# EAGLE design MTAP-Embedded (EAGLE 9.6.2)
ABTEILUNG: Technische Informatik; BEARBEITER: Simon Grundner; DATUM: 2022/10/05; DOKUMENTART: Schaltplan; GEZ: GruS; ID: 4AHEL; REV: 1; SCHALTPLAN: MTAP-MIDI-GC; STATUS: Prototyp; VER: 1.0

## Sheet 1 of 3: ESP32 and Test Terminals
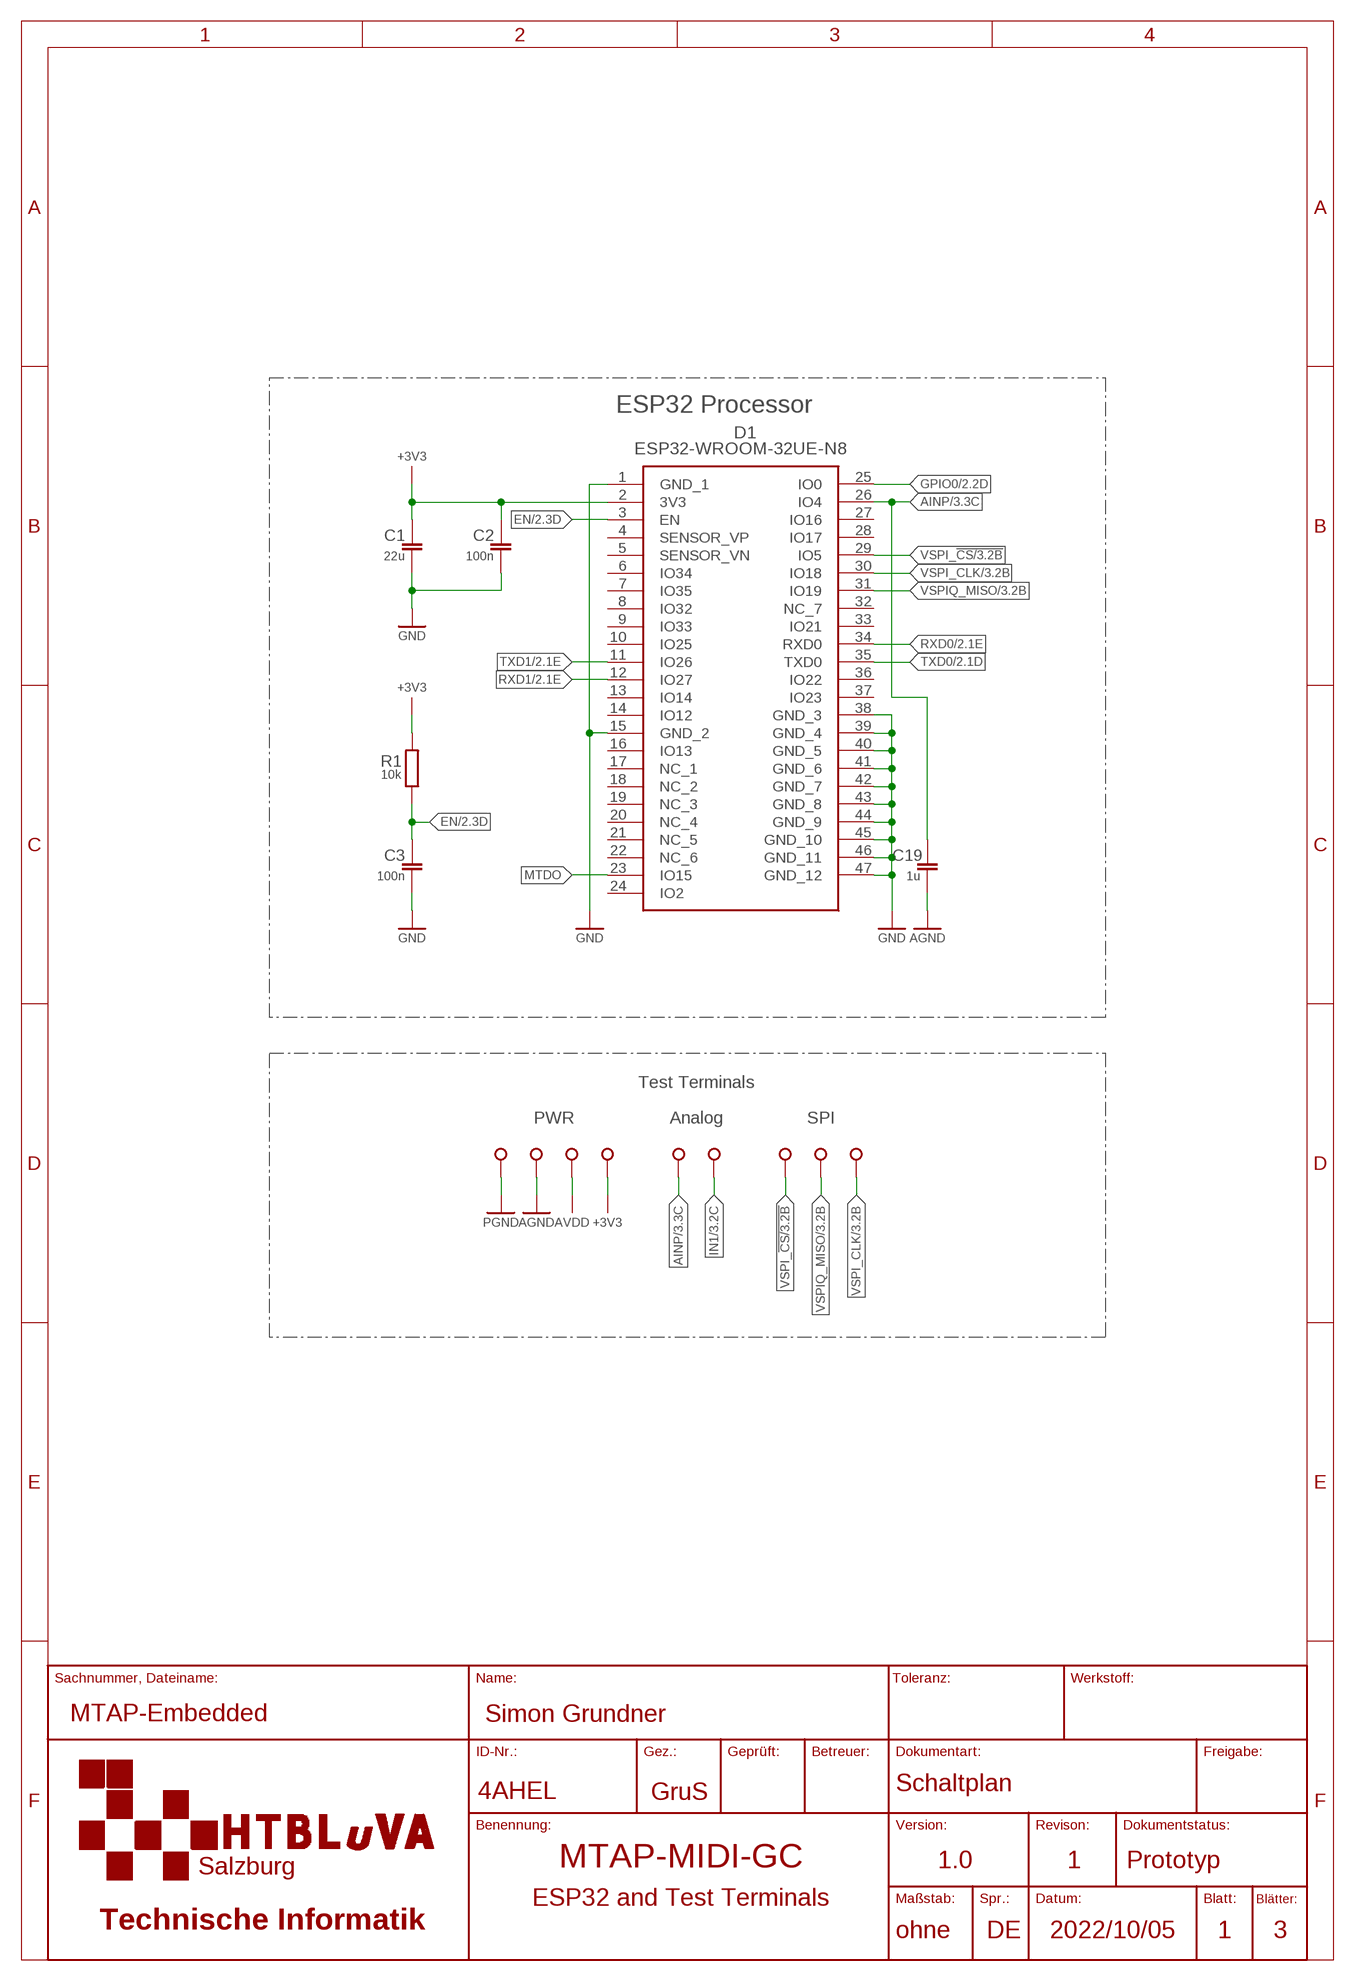
[diagram p0: schematic, sheet 1]

### Parts
3V3  SMD-TP  [S2751-46R]
AGND  SMD-TP  [S2751-46R]
AIN  SMD-TP  [S2751-46R]
AVDD  SMD-TP  [S2751-46R]
C1  22u  C-EUC0805  [C0805]
C2  100n  C-EUC0805  [C0805]
C3  100n  C-EUC0805  [C0805]
C19  1u  C-EUC0805  [C0805]
D1  ESP32-WROOM-32UE-N8  [ESP32WROOM32UEN8]
PGND  SMD-TP  [S2751-46R]
POST-AFE  SMD-TP  [S2751-46R]
R1  10k  R-EUSR0805  [R0805]
SPI_CLK  SMD-TP  [S2751-46R]
SPI_CS  SMD-TP  [S2751-46R]
SPIQ  SMD-TP  [S2751-46R]

### Nets
+3V3: 3V3.P$1 C1.1 C2.1 D1.2(3V3) R1.2 ; also sheet 2,3
AGND: AGND.P$1 C19.2 ; also sheet 2,3
AINP: C19.1 D1.26(IO4) POST-AFE.P$1 ; also sheet 3
AVDD: AVDD.P$1 ; also sheet 3
EN: C3.1 D1.3(EN) R1.1 ; also sheet 2
GND: C1.2 C2.2 C3.2 D1.1(GND_1) D1.15(GND_2) D1.38(GND_3) D1.39(GND_4) D1.40(GND_5) D1.41(GND_6) D1.42(GND_7) D1.43(GND_8) D1.44(GND_9) D1.45(GND_10) D1.46(GND_11) D1.47(GND_12) ; also sheet 2
GPIO0: D1.25(IO0) ; also sheet 2
IN1: AIN.P$1 ; also sheet 3
MTDO: D1.23(IO15)
PGND: PGND.P$1 ; also sheet 2
RXD0: D1.34(RXD0) ; also sheet 2
RXD1: D1.12(IO27) ; also sheet 2
TXD0: D1.35(TXD0) ; also sheet 2
TXD1: D1.11(IO26) ; also sheet 2
VSPI_!CS: D1.29(IO5) SPI_CS.P$1 ; also sheet 3
VSPI_CLK: D1.30(IO18) SPI_CLK.P$1 ; also sheet 3
VSPIQ_MISO: D1.31(IO19) SPIQ.P$1 ; also sheet 3
Unconnected: D1.4(SENSOR_VP) D1.5(SENSOR_VN) D1.6(IO34) D1.7(IO35) D1.8(IO32) D1.9(IO33) D1.10(IO25) D1.13(IO14) D1.14(IO12) D1.16(IO13) D1.17(NC_1) D1.18(NC_2) D1.19(NC_3) D1.20(NC_4) D1.21(NC_5) D1.22(NC_6) D1.24(IO2) D1.27(IO16) D1.28(IO17) D1.32(NC_7) D1.33(IO21) D1.36(IO22) D1.37(IO23)

### Notes on the sheet
- ESP32 Processor
- Test Terminals
- PWR | Analog | SPI

## Sheet 2 of 3: Embedded
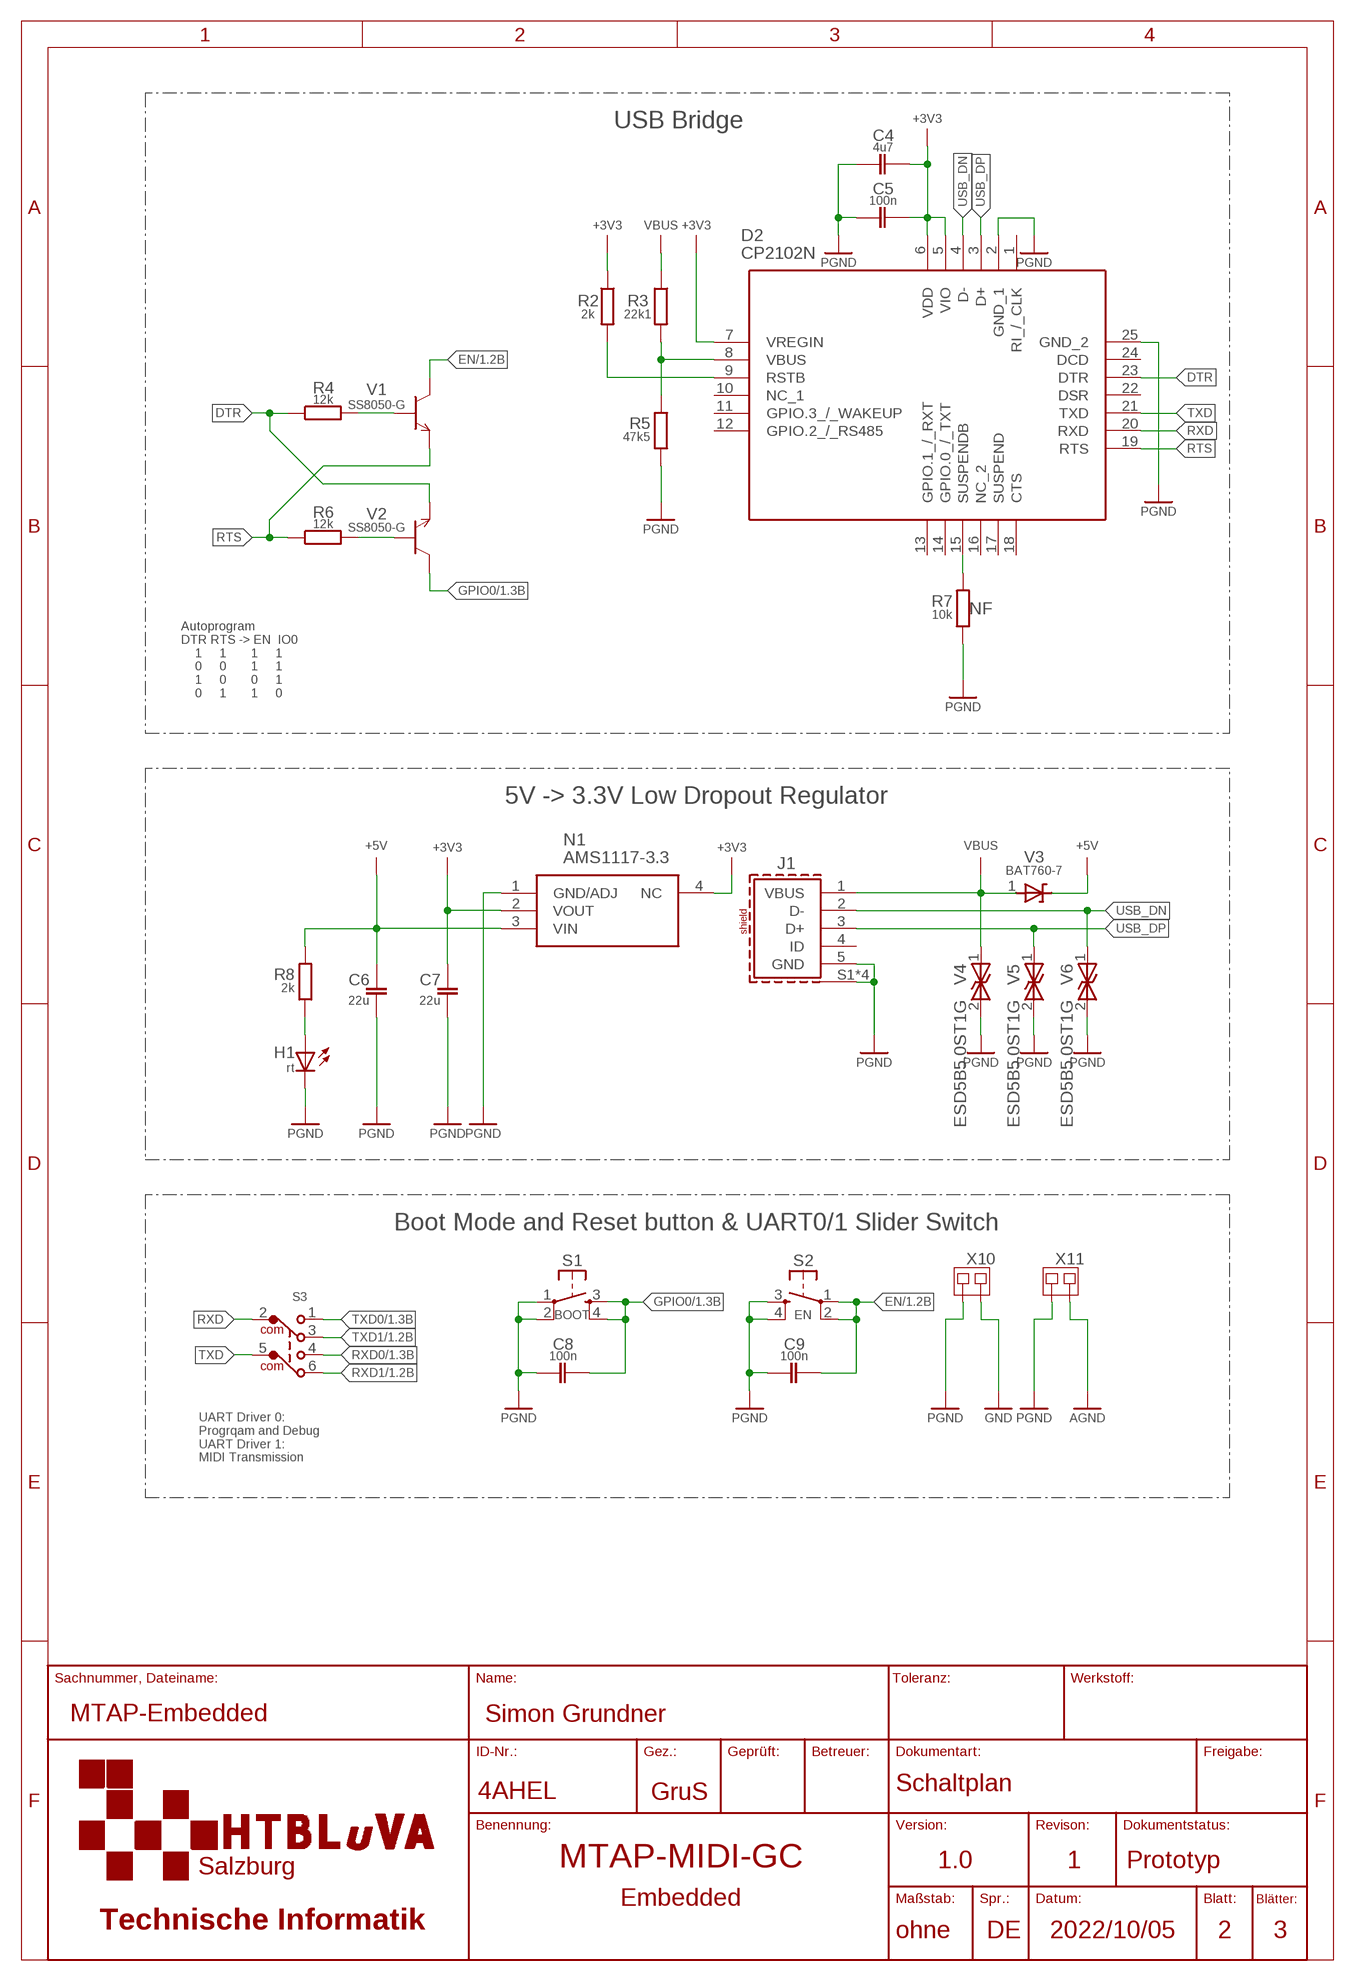
[diagram p1: schematic, sheet 2]

### Parts
C4  4u7  C-EUC0805  [C0805]
C5  100n  C-EUC0805  [C0805]
C6  22u  C-EUC0805  [C0805]
C7  22u  C-EUC0805  [C0805]
C8  100n  C-EULC0805  [C0805]
C9  100n  C-EULC0805  [C0805]
D2  CP2102N  CP2102N-A02-GQFN24  [QFN24]
H1  rt  LEDCHIP-LED0805  [CHIP-LED0805]
J1  629105150521  [629105150521]
N1  AMS1117-3.3  [SOT229P700X180-4N]
R2  2k  R-EUSR0805  [R0805]
R3  22k1  R-EUSR0805  [R0805]
R4  12k  R-EU_R0805  [R0805]
R5  47k5  R-EUSR0805  [R0805]
R6  12k  R-EU_R0805  [R0805]
R7  10k  R-EUSR0805  [R0805]
R8  2k  R-EUSR0805  [R0805]
S1  BOOT  TASTE10XXWE  [WE_436331045822]
S2  EN  TASTE10XXWE  [WE_436331045822]
S3  452404020202  [452404020202]
V1  SS8050-G  [SOT95P240X115-3N]
V2  SS8050-G  [SOT95P240X115-3N]
V3  BAT760-7  [SOD323]
V4  ESD5B5.0ST1G  [SOD523]
V5  ESD5B5.0ST1G  [SOD523]
V6  ESD5B5.0ST1G  [SOD523]
X10  0R  JUMPSMD1FACH-1SHORT  [MYLIB_SJ-SHORT]
X11  0R  JUMPSMD1FACH-1SHORT  [MYLIB_SJ-SHORT]

### Nets
+3V3: C4.1 C5.1 C7.1 D2.5(VIO) D2.6(VDD) D2.7(VREGIN) N1.2(VOUT) N1.4(NC) R2.1 ; also sheet 1,3
+5V: C6.1 N1.3(VIN) R8.2 V3.2(A)
AGND: X11.2 ; also sheet 1,3
DTR: D2.23(DTR) R4.1 V2.2(E)
EN: C9.1 S2.1(P) S2.2(P1) V1.3(C) ; also sheet 1
GND: X10.2 ; also sheet 1
GPIO0: C8.1 S1.3(S) S1.4(S1) V2.3(C) ; also sheet 1
N$1: H1.A R8.1
N$2: D2.8(VBUS) R3.2 R5.2
N$5: D2.15(SUSPENDB) R7.2
N$9: D2.9(RSTB) R2.2
N$15: R4.2 V1.1(B)
N$16: R6.2 V2.1(B)
PGND: C4.2 C5.2 C6.2 C7.2 C8.2 C9.2 D2.2(GND_1) D2.25(GND_2) H1.C J1.5(GND) J1.S1(SHIELD) J1.S2(SHIELD) J1.S3(SHIELD) J1.S4(SHIELD) N1.1(GND/ADJ) R5.1 R7.1 S1.1(P) S1.2(P1) S2.3(S) S2.4(S1) V4.2 V5.2 V6.2 X10.1 X11.1 ; also sheet 1
RTS: D2.19(RTS) R6.1 V1.2(E)
RXD: D2.20(RXD) S3.2(COM)
RXD0: S3.4 ; also sheet 1
RXD1: S3.6 ; also sheet 1
TXD: D2.21(TXD) S3.5(COM1)
TXD0: S3.1 ; also sheet 1
TXD1: S3.3 ; also sheet 1
USB_DN [dp]: D2.4(D-) J1.2(D-) V6.1
USB_DP [dp]: D2.3(D+) J1.3(D+) V5.1
VBUS: J1.1(VBUS) R3.1 V3.1(K) V4.1
Unconnected: D2.1(RI_/_CLK) D2.10(NC_1) D2.11(GPIO.3_/_WAKEUP) D2.12(GPIO.2_/_RS485) D2.13(GPIO.1_/_RXT) D2.14(GPIO.0_/_TXT) D2.16(NC_2) D2.17(SUSPEND) D2.18(CTS) D2.22(DSR) D2.24(DCD) J1.4(ID)

### Notes on the sheet
- USB Bridge
- NF
- Autoprogram
  DTR RTS -> EN  IO0
      1     1       1     1
      0     0       1     1
      1     0       0     1 
      0     1       1     0
- 5V -> 3.3V Low Dropout Regulator
- Boot Mode and Reset button & UART0/1 Slider Switch
- UART Driver 0:
  Progrqam and Debug
  UART Driver 1:
  MIDI Transmission

## Sheet 3 of 3: Analog
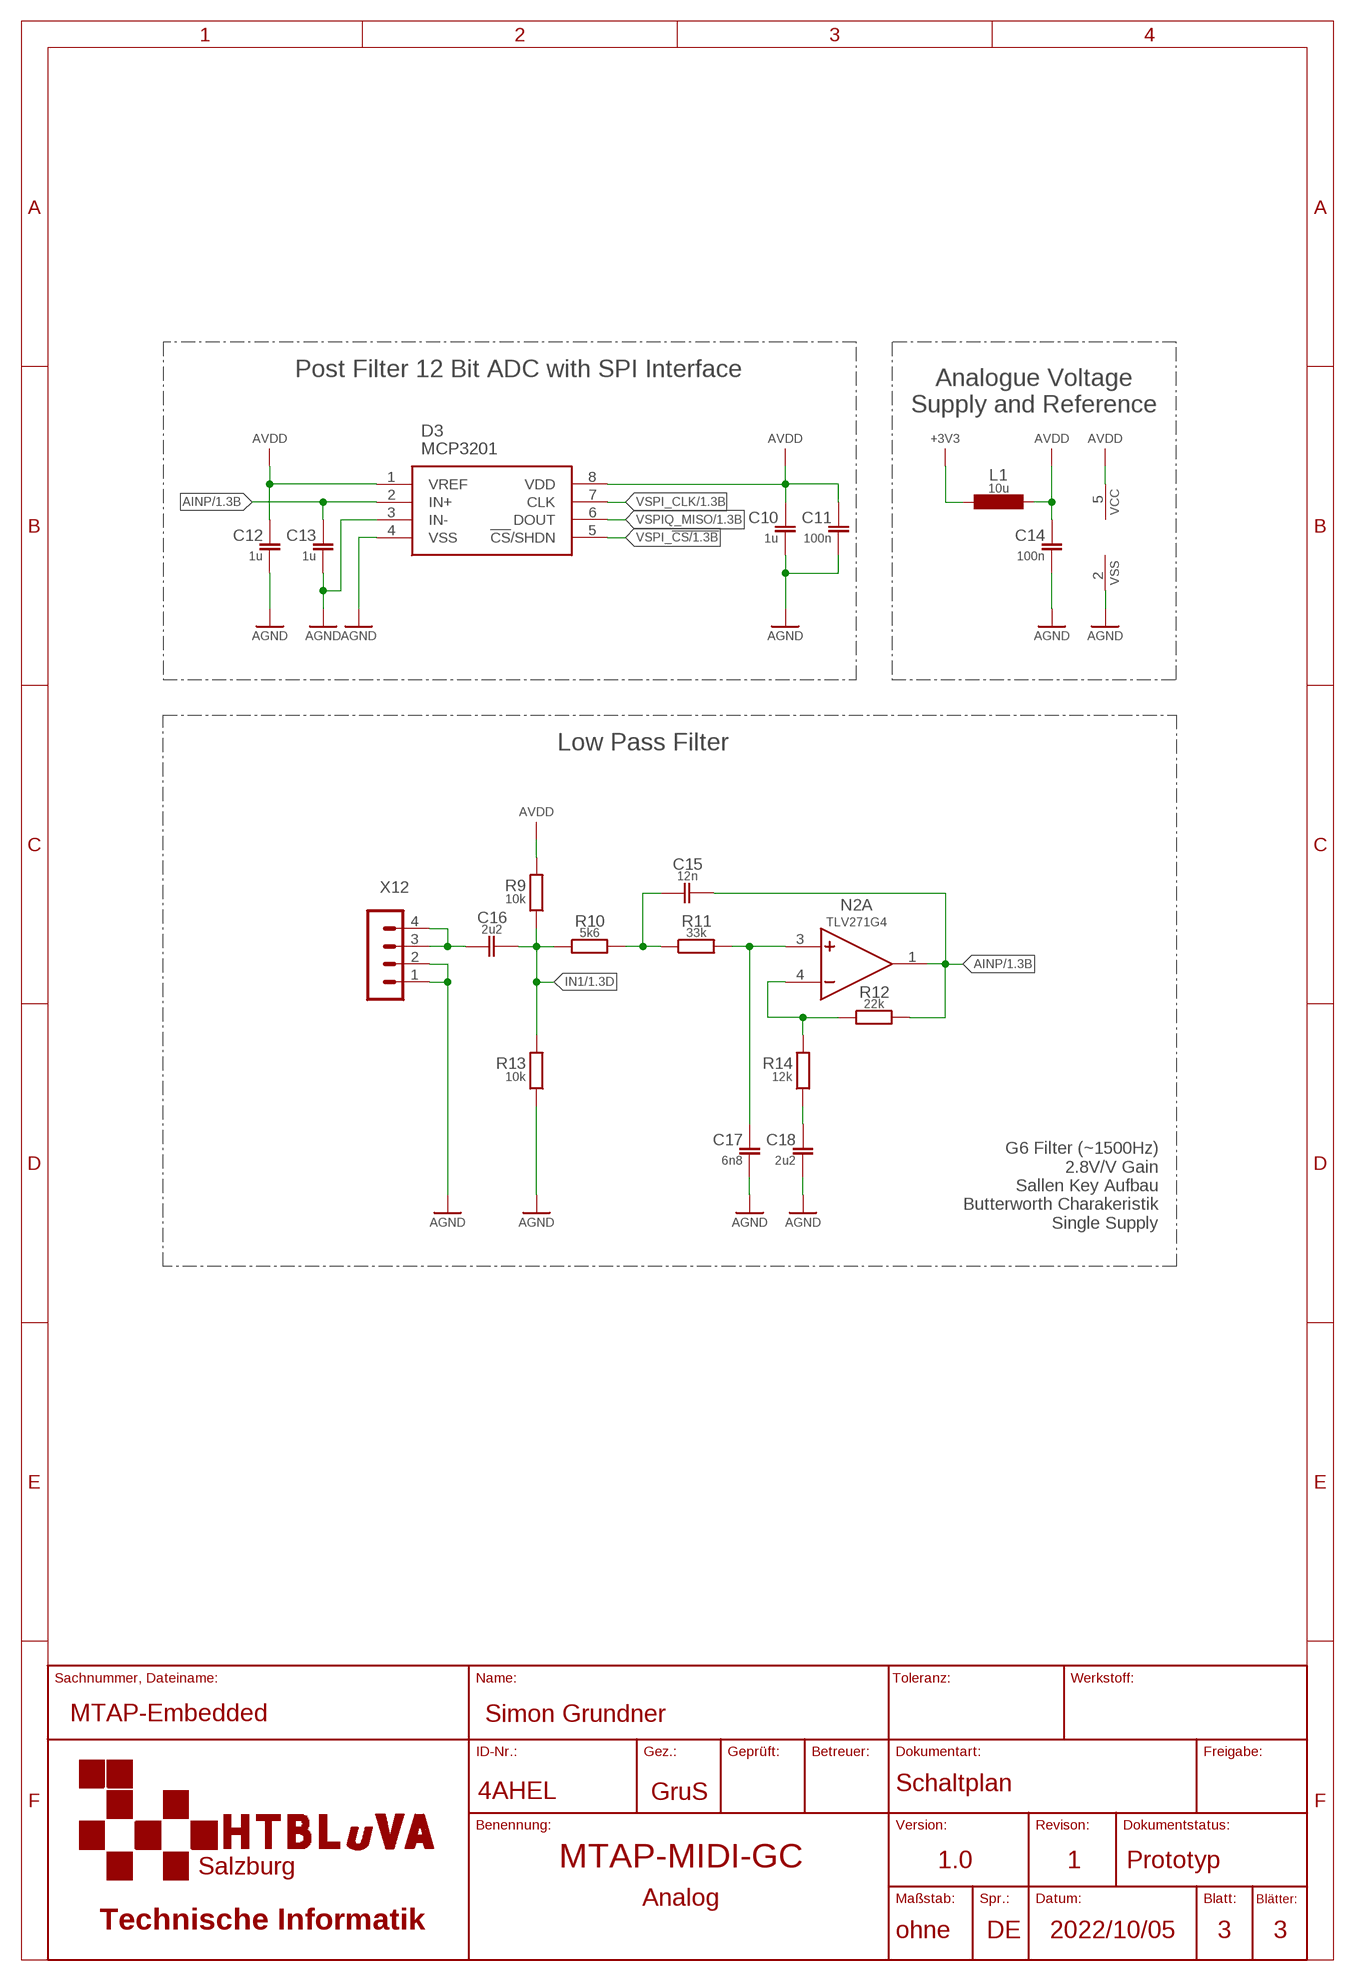
[diagram p2: schematic, sheet 3]

### Parts
C10  1u  C-EUC0805  [C0805]
C11  100n  C-EUC0805  [C0805]
C12  1u  C-EUC0805  [C0805]
C13  1u  C-EUC0805  [C0805]
C14  100n  C-EUC0805  [C0805]
C15  12n  C-EULC0805  [C0805]
C16  2u2  C-EULC0805  [C0805]
C17  6n8  C-EUC0805  [C0805]
C18  2u2  C-EUC0805  [C0805]
D3  MCP3201  MCP3201-CI_SN  [SOIC127P600X175-8N]
L1  10u  L-EU-POERL3216C  [MYLIB_L3216C]
N2  TLV271G4  TLV271CDBVTG4  [SOT95P280X145-5N]
R9  10k  R-EUSR0805  [R0805]
R10  5k6  R-EU_R0805  [R0805]
R11  33k  R-EU_R0805  [R0805]
R12  22k  R-EU_R0805  [R0805]
R13  10k  R-EUSR0805  [R0805]
R14  12k  R-EUSR0805  [R0805]
X12  MA04-1  [MA04-1]

### Nets
+3V3: L1.1 ; also sheet 1,2
AGND: C10.2 C11.2 C12.2 C13.2 C14.2 C17.2 C18.2 D3.3(IN-) D3.4(VSS) N2.2(P:VSS) R13.1 X12.1 X12.2 ; also sheet 1,2
AINP: C13.1 C15.1 D3.2(IN+) N2.1(A:O) R12.2 ; also sheet 1
AVDD: C10.1 C11.1 C12.1 C14.1 D3.1(VREF) D3.8(VDD) L1.2 N2.5(P:VCC) R9.2 ; also sheet 1
IN0: C16.2 X12.3 X12.4
IN1: C16.1 R9.1 R10.1 R13.2 ; also sheet 1
N$3: N2.4(A:N) R12.1 R14.2
N$4: C18.1 R14.1
N$6: C17.1 N2.3(A:P) R11.2
N$7: C15.2 R10.2 R11.1
VSPI_!CS: D3.5(!CS!/SHDN) ; also sheet 1
VSPI_CLK: D3.7(CLK) ; also sheet 1
VSPIQ_MISO: D3.6(DOUT) ; also sheet 1

### Notes on the sheet
- Post Filter 12 Bit ADC with SPI Interface
- Analogue Voltage
  Supply and Reference
- Low Pass Filter
- G6 Filter (~1500Hz)
  2.8V/V Gain
  Sallen Key Aufbau
  Butterworth Charakeristik
  Single Supply

## Library data of the parts
3V3 AGND AIN AVDD PGND POST-AFE SPI_CLK SPI_CS SPIQ = solpad_GruS:SMD-TP
C1-C7 C10-C14 C17-C19 = rcl_GruS:C-EU: CAPACITOR, European symbol
C8 C9 C15 C16 = rcl_GruS:C-EUL: CAPACITOR, European symbol
D1 = modul_GruS:ESP32-WROOM-32UE-N8: Multiprotocol Modules SMD module ESP32-WROOM-32UE, ESP32-D0WD-V3, ESP32 ECO V3, 8 MB SPI flash, IPEX antenna connector Source: Datasheet <https://www.espressif.com/sites/default/files/documentation/esp32-wroom-32e_esp32-wroom-32ue_datasheet_en.pdf>; DESCRIPTION: Multiprotocol Modules SMD module ESP32-WROOM-32UE, ESP32-D0WD-V3, ESP32 ECO V3, 8 MB SPI flash, IPEX antenna connector; HEIGHT: 3.35mm; MANUFACTURER_NAME: Espressif Systems; MANUFACTURER_PART_NUMBER: ESP32-WROOM-32UE-N8; MOUSER_PART_NUMBER: 356-ESP32WRM32UE64UH; MOUSER_PRICE-STOCK: https://www.mouser.co.uk/ProductDetail/Espressif-Systems/ESP32-WROOM-32UE-N8?qs=Li%252BoUPsLEntX6CSaKZB9vw%3D%3D
D2 = ic_GruS:CP2102N-A02-GQFN24: USB Interface IC USB to UART bridge - QFN24 Source: Datasheet <https://componentsearchengine.com/Datasheets/1/CP2102N-A02-GQFN24.pdf>; ARROW_PART_NUMBER: CP2102N-A02-GQFN24; ARROW_PRICE-STOCK: https://www.arrow.com/en/products/cp2102n-a02-gqfn24/silicon-labs; DESCRIPTION: USB Interface IC USB to UART bridge - QFN24; HEIGHT: 0.8mm; MANUFACTURER_NAME: Silicon Labs; MANUFACTURER_PART_NUMBER: CP2102N-A02-GQFN24; MOUSER_PART_NUMBER: 634-CP2102NA02GQFN24; MOUSER_PRICE-STOCK: https://www.mouser.co.uk/ProductDetail/Silicon-Labs/CP2102N-A02-GQFN24?qs=u16ybLDytRYKabtL%2FE7DZA%3D%3D
D3 = adc-dac_GruS:MCP3201-CI_SN: IC, A-D, Converter, 12 bit, SMT, MCP3201CISN Source: Datasheet <http://ww1.microchip.com/downloads/en/DeviceDoc/21290F.pdf>; ARROW_PART_NUMBER: MCP3201-CI/SN; ARROW_PRICE-STOCK: https://www.arrow.com/en/products/mcp3201-cisn/microchip-technology?region=nac; DESCRIPTION: IC, A-D, Converter, 12 bit, SMT, MCP3201CISN; HEIGHT: 1.75mm; MANUFACTURER_NAME: Microchip; MANUFACTURER_PART_NUMBER: MCP3201-CI/SN; MOUSER_PART_NUMBER: 579-MCP3201-CI/SN; MOUSER_PRICE-STOCK: https://www.mouser.co.uk/ProductDetail/Microchip-Technology-Atmel/MCP3201-CI-SN?qs=9y3LFqDLL8L6Qsy36gCZ%252Bw%3D%3D
H1 = led_GruS:LED: LED, EN-60617 OSRAM: - CHIPLED LG R971, LG N971, LY N971, LG Q971, LY Q971, LO R971, LY R971 LH N974, LH R974 LS Q976, LO Q976, LY Q976 LO Q996 - Hyper CHIPLED LW Q18S LB Q993, LB Q99A, LB R99A - SideLED LS A670, LO A670, LY A670, LG A670, LP A670 LB A673, LV A673, LT A673, LW A673 LH A674 LY A675 LS A676, LA A676, LO A676, LY A676, LW A676 LS A679, LY A679, LG A679 - Hyper Micro SIDELED® LS Y876, LA Y876, LO Y876, LY Y876 LT Y87S - SmartLED LW L88C, LW L88S LB L89C, LB L89S, LG L890 LS L89K, LO L89K, LY L89K LS L896, LA L896, LO L896, LY L896 - TOPLED LS T670, LO T670, LY T670, LG T670, LP T670 LSG T670, LSP T670, LSY T670, LOP T670, LYG T670 LG T671, LOG T671, LSG T671 LB T673, LV T673, LT T673, LW T673 LH T674 LS T676, LA T676, LO T676, LY T676, LB T676, LH T676, LSB T676, LW T676 LB T67C, LV T67C, LT T67C, LS T67K, LO T67K, LY T67K, LW E67C LS E67B, LA E67B, LO E67B, LY E67B, LB E67C, LV E67C, LT E67C LW T67C LS T679, LY T679, LG T679 LS T770, LO T770, LY T770, LG T770, LP T770 LB T773, LV T773, LT T773, LW T773 LH T774 LS E675, LA E675, LY E675, LS T675 LS T776, LA T776, LO T776, LY T776, LB T776 LHGB T686 LT T68C, LB T68C - Hyper Mini TOPLED® LB M676 - Mini TOPLED Santana® LG M470 LS M47K, LO M47K, LY M47K Source: http://www.osram.convergy.de LUXEON: - LUMILED® LXK2-PW12-R00, LXK2-PW12-S00, LXK2-PW14-U00, LXK2-PW14-V00 LXK2-PM12-R00, LXK2-PM12-S00, LXK2-PM14-U00 LXK2-PE12-Q00, LXK2-PE12-R00, LXK2-PE12-S00, LXK2-PE14-T00, LXK2-PE14-U00 LXK2-PB12-K00, LXK2-PB12-L00, LXK2-PB12-M00, LXK2-PB14-N00, LXK2-PB14-P00, LXK2-PB14-Q00 LXK2-PR12-L00, LXK2-PR12-M00, LXK2-PR14-Q00, LXK2-PR14-R00 LXK2-PD12-Q00, LXK2-PD12-R00, LXK2-PD12-S00 LXK2-PH12-R00, LXK2-PH12-S00 LXK2-PL12-P00, LXK2-PL12-Q00, LXK2-PL12-R00 Source: www.luxeon.com KINGBRIGHT: KA-3528ASYC Source: www.kingbright.com
J1 = Wurth_Connectors_WR-USB:629105150521: Type B with Pegs, High Current at Pin 1 & Pin 5 Micro USB 2.0 SMT Type B Horizontal 5 Contacts High Current Kind Properties Durability:10 000 Mating cycles Quality Class:10 000 Mating cycles Connector Type:Micro USB Gender:Receptacle Type:Horizontal General Information Operating Temperature:-40up to +105 °C Compliance:RoHS Electrical Properties IR 1:3A Working Voltage:30V (AC) Withstanding Voltage:100V (AC) Contact Resistance:30 mΩ Material Properties Insulator Material:LCP Insulator Flammability Rating:UL94 V-0 Color:Black Contact Material:Copper Alloy Contact Plating: Gold Contact Type:Stamped Shielding Material:Stainless Steel Shielding Plating:Nickel <https://www.we-online.com/catalog/media/o86333v209%20WR-COM_629105150521_family.jpg> Details see: https://www.we-online.com/catalog/en/COM_MICRO_SMT_TYPE_B_HORIZONTAL_HIGH_CURRENT/ Updated by Ella Wu 2021-09-28 2021 (C) Würth Elektronik; APPLICATION: Micro USB 2.0; DATASHEET-URL: https://www.we-online.com/redexpert/spec/629105150521?ae; GERDER: Receptacle; INTERFACE-TYPE: Type B; IR: 3.0A; MOUNT: SMT; PACKAGING: Tape and Reel; PART-NUMBER: 629105150521; PINS: 5; TYPE: Horizontal; VALUE: 629105150521; WORKING-VOLTAGE: 30V(AC)
L1 = rcl_GruS:L-EU-POER: INDUCTOR, European symbol
N1 = vreg_GruS:AMS1117-3.3: Descriptions of ams AMS1117-3.3 provided by its distributors. Source: Datasheet <https://datasheet.datasheetarchive.com/originals/distributors/Datasheets-28/DSA-550594.pdf>; DESCRIPTION: Descriptions of ams AMS1117-3.3 provided by its distributors.; HEIGHT: 1.8mm; MANUFACTURER_NAME: Advanced; MANUFACTURER_PART_NUMBER: AMS1117-3.3
N2 = opv_GruS:TLV271C*: Operational Amplifiers - Op Amps 550-uA/Ch 3-MHz Rail-to-Rail Out Source: Datasheet <https://www.ti.com/lit/gpn/tlv271>; ARROW_PART_NUMBER: TLV271CDBVTG4; ARROW_PRICE-STOCK: https://www.arrow.com/en/products/tlv271cdbvtg4/texas-instruments; DESCRIPTION: Operational Amplifiers - Op Amps 550-uA/Ch 3-MHz Rail-to-Rail Out; HEIGHT: 1.45mm; MANUFACTURER_NAME: Texas Instruments; MANUFACTURER_PART_NUMBER: TLV271CDBVTG4; MOUSER_PART_NUMBER: 595-TLV271CDBVTG4; MOUSER_PRICE-STOCK: https://www.mouser.co.uk/ProductDetail/Texas-Instruments/TLV271CDBVTG4?qs=Fg5TsMy7H4uJktTgmGTZ3w%3D%3D
R1-R3 R5 R7-R9 R13 R14 = rcl_GruS:R-EUS: RESISTOR, European symbol
R4 R6 R10-R12 = rcl_GruS:R-EU_: RESISTOR, European symbol
S1 S2 = switch_GruS:TASTE10XX: OMRON SWITCH
S3 = switch_GruS:452404020202: WS-SLTV THT Mini Slide Switch, Same Side Connection 9.0x3.5 mm Properties Actuator Material:PA9T Actuator Flammability Rating:UL94 HB Actuator Color:Black Frame Material:LCP Frame Flammability Rating:UL94 V-0 Frame Color:Black Contact Material:Copper Alloy Contact Plating:Silver Terminal Material:Copper Alloy Terminal Plating:Silver Schematic:DPDT Switching Function:On-On Connection Type:Same Side Connection Operating Temperature:-40 up to +85 °C Qty.:200 Material Properties Cover Material :Stainless Steel Mechanical Properties Electrical Life:2000 Steps Switching Function:On-On Connection Type:Same Side Connection Packaging Properties Packaging :Bulk <https://www.we-online.com/catalog/media/o107346v209%20Family_WS-SLTV_452404020202.jpg> Details see: https://www.we-online.com/catalog/en/SLTV_9X3_5_THT/ Updated by yingchun,Shan;2020-02-24 2020(C) Würth Elektronik; DATASHEET-URL: https://www.we-online.com/catalog/datasheet/452404020202.pdf; PACKAGING: Bulk; PART-NUMBER: 452404020202; QTY: 200
V1 V2 = transistor_GruS:SS8050-G: Bipolar Transistors - BJT NPN TRANSISTOR 1.5A 40V Source: Datasheet <https://datasheet.datasheetarchive.com/originals/distributors/DKDS-12/229454.pdf>; ARROW_PART_NUMBER: SS8050-G; ARROW_PRICE-STOCK: https://www.arrow.com/en/products/ss8050-g/comchip-technology?region=nac; DESCRIPTION: Bipolar Transistors - BJT NPN TRANSISTOR 1.5A 40V; HEIGHT: 1.15mm; MANUFACTURER_NAME: Comchip Technology; MANUFACTURER_PART_NUMBER: SS8050-G; MOUSER_PART_NUMBER: 750-SS8050-G; MOUSER_PRICE-STOCK: https://www.mouser.co.uk/ProductDetail/Comchip-Technology/SS8050-G?qs=LLUE9lz1YbcHg%252BWLMAtcrQ%3D%3D
V3 = diode_GruS:BAT760-7: Diode Schottky 30V 1A 2Pin SOD323 Diodes Inc BAT760-7, SMT Schottky Diode, 30V 1A, 2-Pin SOD-323 Source: Datasheet <https://www.diodes.com/assets/Datasheets/ds30498.pdf>; ARROW_PART_NUMBER: BAT760-7; ARROW_PRICE-STOCK: https://www.arrow.com/en/products/bat760-7/diodes-incorporated?region=asia; DESCRIPTION: Diode Schottky 30V 1A 2Pin SOD323 Diodes Inc BAT760-7, SMT Schottky Diode, 30V 1A, 2-Pin SOD-323; HEIGHT: 1.2mm; MANUFACTURER_NAME: Diodes Inc.; MANUFACTURER_PART_NUMBER: BAT760-7; MOUSER_PART_NUMBER: 621-BAT760-7; MOUSER_PRICE-STOCK: https://www.mouser.co.uk/ProductDetail/Diodes-Incorporated/BAT760-7?qs=JV7lzlMm3yKDDyO09xoRbQ%3D%3D
V4-V6 = diode_GruS:ESD5B5.0ST1G: Source: Datasheet <http://www.onsemi.com/pub/Collateral/ESD5B5.0ST1-D.PDF>
X10 X11 = con_GruS:JUMPSMD1FACH-1: SMD solder JUMPER
X12 = con-lstb:MA04-1: PIN HEADER; OC_FARNELL: unknown; OC_NEWARK: unknown

## Net classes
0 default: width 0.152 mm, clearance 0.205 mm
1 +3V3: width 0.813 mm
2 VBUS: width 0.813 mm
3 +5V: width 0.813 mm

## Board
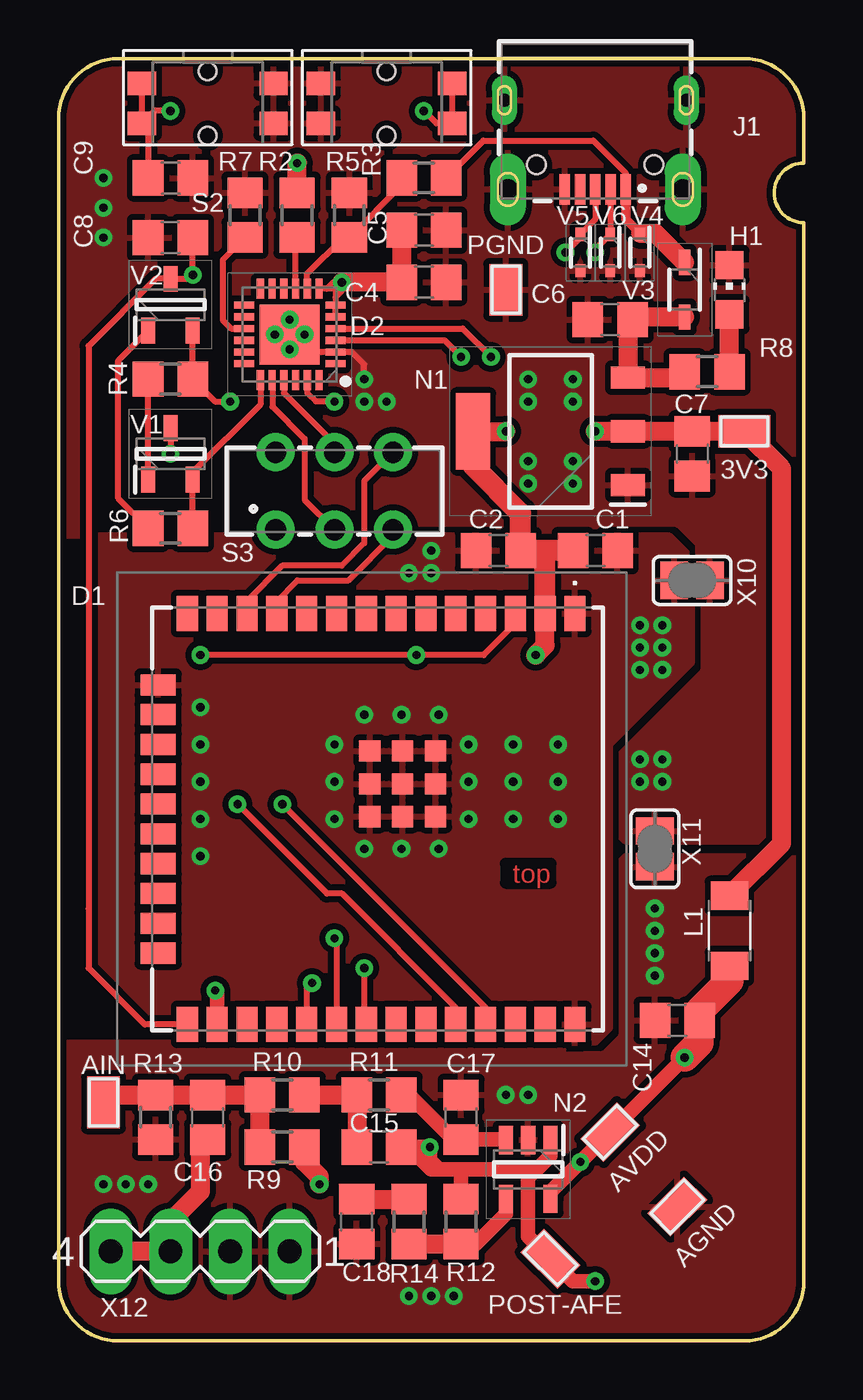
[diagram p3: board, top side]
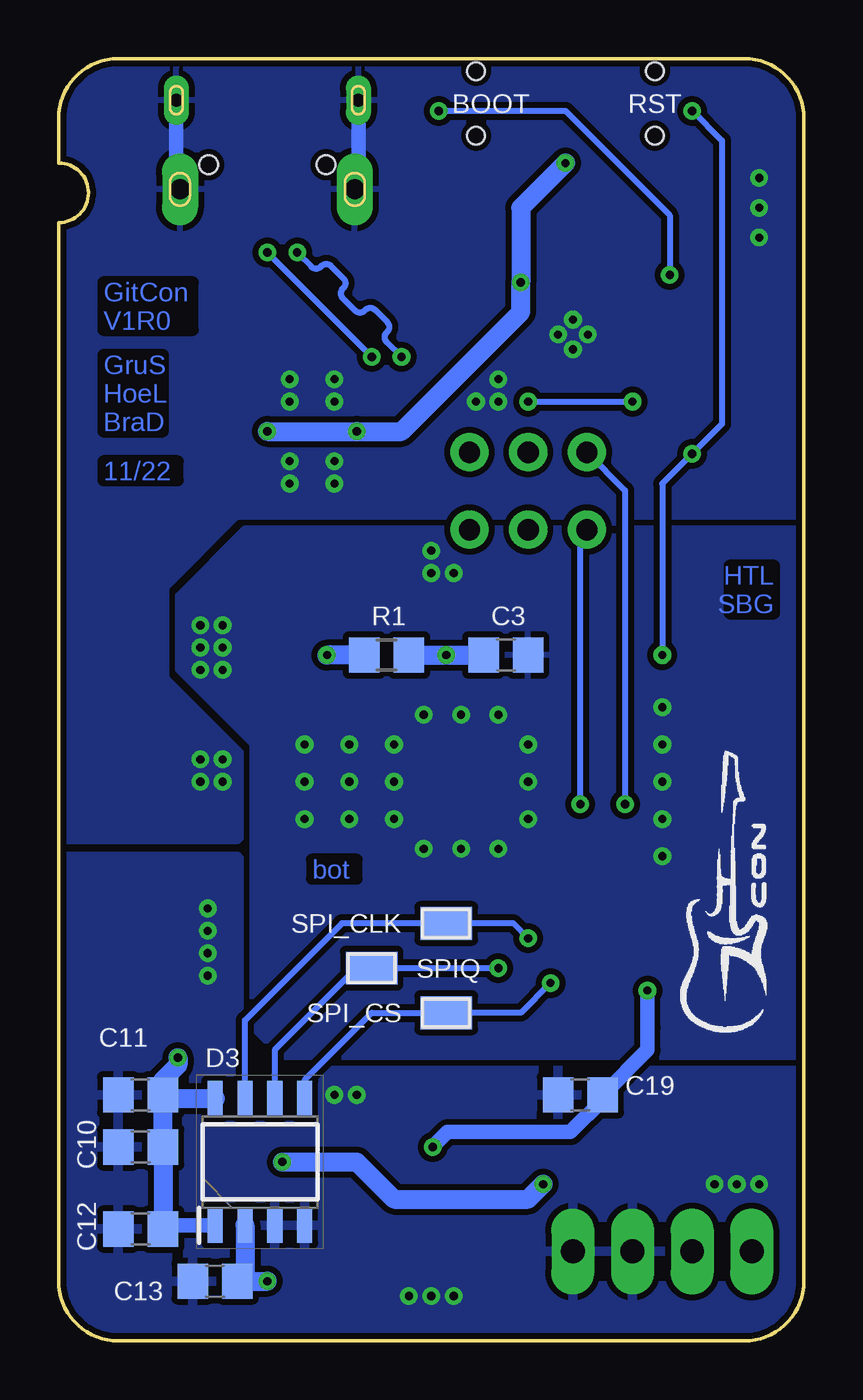
[diagram p4: board, bottom side, seen from below]

Size 31.75 x 54.61 mm. Coordinates in mm from the lower left corner, seen from the top.
Outline: 29.21,54.61 2.54,54.61 arc90 0,52.07 0,2.54 arc90 2.54,0 29.21,0 arc90 31.75,2.54 31.75,47.62 arc-180 31.75,50.16 31.75,52.07 arc90 29.21,54.61
Copper layers (1*16): Top 0.035mm / dielectric 1.6mm / Bottom 0.035mm
Design rules "jlcpcb-2layers *": minimum track width 5mil, minimum drill 0.3mm, track to track 5mil, track to pad 5mil, pad to pad 5mil, via to via 5mil, smd to smd 5mil, copper to edge 0.2mm, drill to drill 6mil, minimum pad ring 10mil, minimum via ring 3mil, stop-mask expansion 5mil, vias tented up to drill 0mil, thermal gap 10mil
Holes 0.75 mm at 13.97,54.08 6.35,51.33 6.35,54.08 13.97,51.33 13.97,54.08 6.35,51.33 6.35,54.08 13.97,51.33 13.97,54.08 6.35,54.08 13.97,51.33 6.35,51.33 13.97,54.08 6.35,54.08 13.97,51.33 6.35,51.33 13.97,54.08 6.35,54.08 13.97,51.33 6.35,51.33 13.97,54.08 6.35,54.08 13.97,51.33 6.35,51.33 13.97,54.08 6.35,54.08 13.97,51.33 6.35,51.33 13.97,54.08 6.35,51.33 6.35,54.08 13.97,51.33 13.97,54.08 6.35,51.33 6.35,54.08 13.97,51.33 13.97,54.08 6.35,51.33 6.35,54.08 13.97,51.33

### Footprints (pad centres in the part's own frame; a part is rotated, then mirrored left to right if it is on the bottom)
S2751-46R = smd 2.2 x 1.4: P$1 0,0
C0805 = smd 1.3 x 1.5: 1 -0.95,0; 2 0.95,0
ESP32WROOM32UEN8 = smd 1.5 x 0.9: 1 -8.75,8.66; 2 -8.75,7.39; 3 -8.75,6.12; 4 -8.75,4.85; 5 -8.75,3.58; 6 -8.75,2.31; 7 -8.75,1.04; 8 -8.75,-0.23; 9 -8.75,-1.5; 10 -8.75,-2.77; 11 -8.75,-4.04; 12 -8.75,-5.31; 13 -8.75,-6.58; 14 -8.75,-7.85; 25 8.75,-7.85; 26 8.75,-6.58; 27 8.75,-5.31; 28 8.75,-4.04; 29 8.75,-2.77; 30 8.75,-1.5; 31 8.75,-0.23; 32 8.75,1.04; 33 8.75,2.31; 34 8.75,3.58; 35 8.75,4.85; 36 8.75,6.12; 37 8.75,7.39; 38 8.75,8.66 | smd 0.9 x 1.5: 15 -5.715,-9.1; 16 -4.445,-9.1; 17 -3.175,-9.1; 18 -1.905,-9.1; 19 -0.635,-9.1; 20 0.635,-9.1; 21 1.905,-9.1; 22 3.175,-9.1; 23 4.445,-9.1; 24 5.715,-9.1 | smd 0.9 x 0.9: 39 -1.5,1.32; 40 -2.9,1.32; 41 -2.9,-0.08; 42 -1.5,-0.08; 43 -0.1,-0.08; 44 -0.1,1.32; 45 -0.1,2.72; 46 -1.5,2.72; 47 -2.9,2.72
QFN24 = smd 0.85 x 0.3: 1 -1.95,1.25; 2 -1.95,0.75; 3 -1.95,0.25; 4 -1.95,-0.25; 5 -1.95,-0.75; 6 -1.95,-1.25; 13 1.95,-1.25; 14 1.95,-0.75; 15 1.95,-0.25; 16 1.95,0.25; 17 1.95,0.75; 18 1.95,1.25 | smd 0.3 x 0.85: 7 -1.25,-1.95; 8 -0.75,-1.95; 9 -0.25,-1.95; 10 0.25,-1.95; 11 0.75,-1.95; 12 1.25,-1.95; 19 1.25,1.95; 20 0.75,1.95; 21 0.25,1.95; 22 -0.25,1.95; 23 -0.75,1.95; 24 -1.25,1.95 | smd 2.55 x 2.55: 25 0,0
SOIC127P600X175-8N = smd 1.5 x 0.65: 1 -2.7,1.905; 2 -2.7,0.635; 3 -2.7,-0.635; 4 -2.7,-1.905; 5 2.7,-1.905; 6 2.7,-0.635; 7 2.7,0.635; 8 2.7,1.905
CHIP-LED0805 = smd 1.2 x 1.2: A 0,-1.05; C 0,1.05
629105150521 = smd 0.45 x 1.3: 1 -1.3,2.9; 2 -0.65,2.9; 3 0,2.9; 4 0.65,2.9; 5 1.3,2.9 | drill 0.85 pad 1 long: S1 -3.725,2.9; S2 3.725,2.9 | drill 0.55 pad 0.9 long: S3 3.875,-0.9; S4 -3.875,-0.9 | hole 0.8: -2.5,1.85; 2.5,1.85
MYLIB_L3216C = smd 1.2 x 1.6: 1 -1.5,0; 2 1.5,0
SOT229P700X180-4N = smd 1.45 x 0.95: 1 -3.3,2.29; 2 -3.3,0; 3 -3.3,-2.29 | smd 1.45 x 3.25: 4 3.3,0
SOT95P280X145-5N = smd 1.2 x 0.6: 1 -1.25,0.95; 2 -1.25,0; 3 -1.25,-0.95; 4 1.25,-0.95; 5 1.25,0.95
R0805 = smd 1.3 x 1.5: 1 -0.95,0; 2 0.95,0
WE_436331045822 = smd 1.2 x 1: 1 2.8,0.85; 2 2.8,-0.85; 3 -2.8,0.85; 4 -2.8,-0.85 | hole 0.75: 0,1.375; 0,-1.375
452404020202 = drill 0.9: 1 2.5,1.65; 2 0,1.65; 3 -2.5,1.65; 4 2.5,-1.65; 5 0,-1.65; 6 -2.5,-1.65
SOT95P240X115-3N = smd 1.1 x 0.6: 1 -1.1,0.95; 2 -1.1,-0.95; 3 1.1,0
SOD323 = smd 1.075 x 0.5: 1 -1.162,0; 2 1.162,0
SOD523 = smd 0.57 x 0.42: 1 -0.775,0; 2 0.775,0
MYLIB_SJ-SHORT = smd 1.168 x 1.6: 1 -0.762,0; 2 0.762,0
MA04-1 = drill 1.016 long: 1 -3.81,0; 2 -1.27,0; 3 1.27,0; 4 3.81,0

### Placement (x,y rotation side)
3V3  29.21,38.73 180 top
AGND  26.35,5.71 225 top
AIN  1.91,10.16 270 top
AVDD  23.5,8.89 45 top
C1  22.86,33.66 0 top
C2  18.73,33.66 180 top
C3  12.7,29.21 0 bottom
C4  15.56,45.09 0 top
C5  15.56,47.31 0 top
C6  23.5,43.5 180 top
C7  26.99,37.78 270 top
C8  4.76,46.99 180 top
C9  4.76,49.53 0 top
C10  28.26,8.26 180 bottom
C11  28.26,10.48 180 bottom
C12  28.26,4.76 180 bottom
C13  25.08,2.54 180 bottom
C14  26.35,13.65 180 top
C15  13.65,8.26 180 top
C16  6.35,9.53 270 top
C17  17.14,9.53 90 top
C18  12.7,5.08 270 top
C19  9.53,10.48 180 bottom
D1  13.34,22.23 270 top
D2  9.84,42.86 180 top
D3  23.18,7.62 90 bottom
FABRICATION  [FABRIACTION]  -16.12,-12.56 0 top  (outside the outline)
H1  28.57,44.77 0 top
J1  22.86,51.94 180 top
L1  28.57,17.46 270 top
MEASURE  [MEASURE]  0,0 0 top
N1  20.95,38.73 180 top
N2  20,7.3 270 top
PGND  19.05,44.77 270 top
POST-AFE  20.95,3.49 315 top
R1  17.78,29.21 180 bottom
R2  10.16,47.94 270 top
R3  15.56,49.53 180 top
R4  4.76,40.96 180 top
R5  12.38,47.94 270 top
R6  4.76,34.61 180 top
R7  7.94,47.94 270 top
R8  27.62,41.27 180 top
R9  9.53,8.26 0 top
R10  9.53,10.48 0 top
R11  13.65,10.48 0 top
R12  17.14,5.08 90 top
R13  4.13,9.53 90 top
R14  14.92,5.08 270 top
S1  13.97,52.7 180 top
S2  6.35,52.7 180 top
S3  11.75,36.2 180 top
SPI_CLK  15.24,17.78 0 bottom
SPI_CS  15.24,13.97 0 bottom
SPIQ  18.41,15.88 0 bottom
V1  4.76,37.78 90 top
V2  4.76,44.13 90 top
V3  26.67,44.77 270 top
V4  24.77,46.35 270 top
V5  22.23,46.35 270 top
V6  23.5,46.35 270 top
X10  26.99,32.38 180 top
X11  25.4,20.95 270 top
X12  6.03,3.81 180 top

### Tracks (layer width: path | path; a pad name or v marks a point on that pad's centre or on a via)
+3V3  (via drill 0.35 pad 0.75)
  Top 0.254: 11.79,44.81 11.43,44.81 | 11.43,44.81 D2.7 | v12.06,45.09 11.79,44.81 | 11.79,44.81 11.79,44.45 | 11.79,44.45 D2.6 D2.5 | v12.06,45.09 11.7,45.09 11.43,44.81 | v12.06,45.09 12.06,44.72 11.79,44.45
  Top 0.813: C5.1 C4.1 v12.06,45.09 | R2.1 v10.16,50.16 | L1.1 30.8,21.18 30.8,37.15 3V3.P$1 C7.1 N1.2 v22.86,38.73 | v20.32,29.21 20.73,29.61 D1.2 | N1.4 v19.05,38.73
  Top 0.889: D1.2 20.73,33.66 C1.1 C2.1 19.68,35.24 17.66,37.27 N1.4
  Bottom 0.813: v10.16,50.16 12.06,48.26 v12.06,45.09 12.06,43.81 17.14,38.73 v19.05,38.73 v22.86,38.73 | R1.2 v20.32,29.21
+5V
  Top 0.813: V3.2 24.55,43.6 C6.1 24.25,43.31 N1.3 26.42,41.02 R8.2
AGND  (via drill 0.35 pad 0.75)
  other vias: 25.4,17.46 25.4,16.51 25.4,15.56 25.4,18.41 16.83,1.91 15.88,1.91 14.92,1.91 19.05,10.48 20,10.48 1.91,6.67 2.86,6.67 3.81,6.67
  pour Bottom (isolate 0.254, rank 4): 0,0 31.75,0 31.75,20.64 24.13,20.64 23.5,20 23.5,13.34 22.23,12.06 0,12.06
  pour Top (isolate 0.254, rank 4): 31.75,20.64 24.13,20.64 23.5,20 23.5,13.02 23.18,12.7 0,12.7 0,0 31.75,0
AINP  (via drill 0.35 pad 0.75)
  Top 0.61: R12.2 17.14,7.3 | 20.37,7.3 20.95,7.88 N2.1 | 17.14,7.3 20.37,7.3 | 20.37,7.3 20,6.93 20,4.45 POST-AFE.P$1 21.91,2.54 v22.86,2.54 | C15.1 v15.81,8.26 15.81,7.68 | v6.67,14.92 6.75,14.84 D1.26 | 16.19,7.3 17.14,7.3 | 15.81,7.68 16.19,7.3 | 15.81,7.68 15.24,8.26 C15.1 | 16.19,7.3 15.87,7.3 14.92,8.26 C15.1
  Bottom 0.61: v15.81,8.26 15.18,8.89 9.94,8.89 8.57,10.26 C19.1 6.67,12.38 6.67,13.34 v6.67,14.92
  Bottom 0.813: D3.2 23.81,2.86 C13.1 v22.86,2.54
AVDD  (via drill 0.35 pad 0.75)
  Top 0.61: N2.5 20.95,6.35 v22.23,7.62 AVDD.P$1 v26.67,12.06
  Top 0.813: R9.2 10.47,7.62 11.11,6.99 v11.11,6.67
  Top 1.219: v26.67,12.06 27.3,12.7 C14.1 27.3,14.05 28.57,15.33 L1.2
  Bottom 0.61: D3.1 27.15,4.92 C12.1
  Bottom 0.813: C12.1 C10.1 C11.1 | v22.23,7.62 19.05,7.62 17.46,6.03 11.75,6.03 v11.11,6.67 | v26.67,12.06 26.67,11.75 27.31,11.11 C11.1 | C11.1 27.15,10.32 D3.8
DTR  (via drill 0.35 pad 0.75)
  Top 0.254: v11.75,40.01 10.96,40.01 10.59,40.37 D2.23 | v7.3,40.01 6.67,40.01 R4.1 V2.2
  Bottom 0.254: v11.75,40.01 v7.3,40.01
EN  (via drill 0.35 pad 0.75)
  Top 0.254: S2.1 S2.2 | v4.76,52.39 4.08,52.39 S2.1 | S2.1 3.81,51.59 C9.1 | v6.03,29.21 v15.24,29.21 18.1,29.21 19.45,30.57 D1.3 | V1.3 v4.76,37.78
  Bottom 0.254: v4.76,52.39 3.49,51.12 3.49,39.05 v4.76,37.78 6.03,36.51 v6.03,29.21
  Bottom 0.813: C3.1 v15.24,29.21 R1.1
GND  (via drill 0.35 pad 0.75)
  other vias: 11.75,25.4 11.75,23.81 11.75,22.23 13.02,20.95 14.61,20.95 16.19,20.95 17.46,22.23 17.46,23.81 17.46,25.4 13.02,26.67 14.61,26.67 16.19,26.67 24.77,29.53 24.77,28.57 25.72,29.53 25.72,28.57 25.72,30.48 24.77,30.48 19.37,25.4 21.27,25.4 19.37,23.81 19.37,22.23 21.27,22.23 21.27,23.81 6.03,25.4 6.03,23.81 6.03,22.23 6.03,20.64 6.03,26.99 14.92,32.7 15.88,32.7 15.88,33.66
  pour Top (isolate 0.254, rank 3): 0,12.7 22.86,12.7 23.5,13.34 23.5,25.4 26.99,28.89 26.99,33.34 26.04,34.29 0,34.29
  pour Bottom (isolate 0.254, rank 3): 0,12.06 22.23,12.06 23.5,13.34 23.5,25.4 26.67,28.57 26.67,31.75 23.81,34.61 0,34.61
GPIO0  (via drill 0.35 pad 0.75)
  Top 0.254: C8.1 v5.71,45.41 v5.71,45.4 5.54,45.23 V2.3 4.13,45.23 1.27,42.38 1.27,18.41 1.27,15.88 3.67,13.47 D1.25 | v15.56,52.39 16.09,51.85 S1.3 S1.4
  Bottom 0.254: v15.56,52.39 10.16,52.39 5.71,47.94 v5.71,45.4
IN0
  Top 0.813: C16.2 6.03,8.26 6.03,6.35 4.76,5.08 X12.3 X12.4
IN1
  Top 0.813: R9.1 R10.1 C16.1 R13.2 2.22,10.47 AIN.P$1
N$1
  Top 0.813: R8.1 H1.A
N$2
  Top 0.254: D2.8 10.59,45.45 12.14,46.99 R5.2 14.61,49.22 R3.2
N$3
  Top 0.61: R12.1 17.78,4.13 19.05,5.4 N2.4
  Top 0.813: R14.2 R12.1
N$4
  Top 0.813: C18.1 R14.1
N$5
  Top 0.254: R7.2 6.99,46.04 6.99,43.48 7.35,43.11 D2.15
N$6
  Top 0.61: N2.3 19.03,8.57 C17.1 16.82,8.57 14.92,10.48 R11.2
N$7
  Top 0.813: R10.2 R11.1 C15.2
N$9
  Top 0.254: D2.9 10.09,46.92 R2.2
N$15
  Top 0.254: V1.1 R4.2
N$16
  Top 0.254: R6.2 2.54,35.88 2.54,41.76 V2.1
PGND  (via drill 0.35 pad 0.75)
  Top 0.254: v9.84,42.23 9.96,42.11 D2.2 12.5,42.11 13.02,41.59 v13.02,40.96
  Bottom 0.61: J1.S3 18.98,49.19 J1.S2 | J1.S4 26.73,49.19 J1.S1
  other vias: 10.48,42.86 9.84,43.5 9.21,42.86 1.91,46.99 1.91,48.26 1.91,49.53 24.77,24.77 24.77,23.81 25.72,24.77 25.72,23.81 20,40.96 21.91,40.96 20,36.51 21.91,36.51 21.91,37.47 21.91,40.01 20,40.01 20,37.47 13.02,40.01 13.97,40.01
  pour Top (isolate 0.254, rank 4): 23.5,21.91 24.13,21.27 31.75,21.27 31.75,54.61 0,54.61 0,34.29 25.4,34.29 26.99,32.7 26.99,28.89 23.5,25.4
  pour Bottom (isolate 0.254, rank 4): 23.5,21.91 24.13,21.27 31.75,21.27 31.75,54.61 0,54.61 0,34.61 23.81,34.61 26.67,31.75 26.67,28.57 23.5,25.4
RTS
  Top 0.254: R6.1 V1.2 5.71,37 8.59,39.88 D2.19
RXD
  Top 0.254: S3.2 10.48,35.81 10.48,38.42 9.11,39.78 9.11,40.9 D2.20
RXD0  (via drill 0.35 pad 0.75)
  Top 0.254: D1.34 16.91,14.2 12.06,19.05 11.43,19.05 v7.62,22.86
  Bottom 0.254: v7.62,22.86 7.62,36.22 S3.4
RXD1
  Top 0.254: S3.6 13.02,36.62 13.02,33.97 12.06,33.02 9.53,33.02 8.03,31.52 D1.12
TXD
  Top 0.254: S3.5 11.75,38.21 9.59,40.37 D2.21
TXD0  (via drill 0.35 pad 0.75)
  Top 0.254: D1.35 18.18,14.2 v9.53,22.86
  Bottom 0.254: v9.53,22.86 9.53,34.27 S3.1
TXD1
  Top 0.254: D1.11 9.29,31.52 10.16,32.38 12.34,32.38 14.25,34.29 S3.3
USB_DN  (via drill 0.35 pad 0.75)
  Top 0.254: v22.86,46.35 22.86,46.49 V6.1 23.5,49.03 J1.2 | D2.4 17.21,43.11 v18.41,41.91
  Bottom 0.254: v22.86,46.35 v18.41,41.91
USB_DP  (via drill 0.35 pad 0.75)
  Top 0.254: v21.59,46.35 22.23,46.99 V5.1 22.86,47.77 J1.3 | D2.3 16.44,42.61 v17.14,41.91
  Bottom 0.254: v21.59,46.35 20.98,45.75 arc-90 20.58,45.75 20.55,45.78 arc90 20.15,45.78 19.62,45.25 arc90 19.62,44.85 19.65,44.82 arc-90 19.65,44.41 19.12,43.88 arc-90 18.71,43.88 18.68,43.91 arc90 18.28,43.91 17.75,43.38 arc90 17.75,42.98 17.78,42.95 arc-90 17.78,42.55 v17.14,41.91
VBUS
  Top 0.254: R3.1 18.09,51.12 22.78,51.12 24.16,49.74 J1.1
  Top 0.406: J1.1 24.16,47.77 24.78,47.15 | 24.8,47.16 24.78,47.15 | 24.78,47.15 V4.1
  Top 0.813: V3.1 25.44,47.16 24.8,47.16
VSPI_!CS  (via drill 0.35 pad 0.75)
  Top 0.254: v10.79,15.24 10.56,15.01 D1.29
  Bottom 0.254: D3.5 21.27,11.11 18.41,13.97 SPI_CS.P$1 12.06,13.97 v10.79,15.24
VSPI_CLK  (via drill 0.35 pad 0.75)
  Top 0.254: v11.75,17.14 11.84,17.06 D1.30
  Bottom 0.254: D3.7 23.81,13.65 19.68,17.78 SPI_CLK.P$1 12.38,17.78 v11.75,17.14
VSPIQ_MISO  (via drill 0.35 pad 0.75)
  Top 0.254: v13.02,15.88 13.02,13.56 D1.31
  Bottom 0.254: D3.6 22.54,12.38 19.05,15.88 SPIQ.P$1 v13.02,15.88

### Text on the board
Top: top
Bottom: GitCon / V1R0 | GruS / HoeL / BraD | 11/22 | HTL / SBG | bot
bNames: RST | BOOT